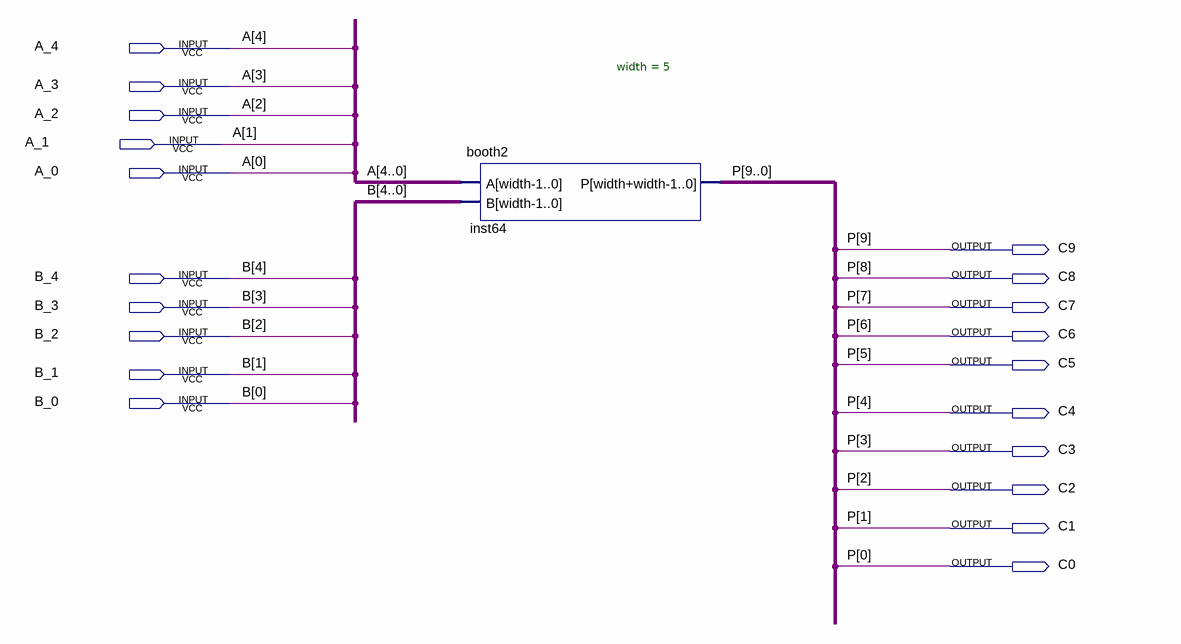
[diagram p0: schematic sheet]
// Quartus schematic Block1.bdf as structural Verilog: 1 symbols, 20 pins
module Block1 (
  input  A_4,
  input  A_3,
  input  A_2,
  input  A_1,
  input  A_0,
  input  B_4,
  input  B_3,
  input  B_2,
  input  B_1,
  input  B_0,
  output C9,
  output C8,
  output C7,
  output C6,
  output C5,
  output C4,
  output C3,
  output C2,
  output C1,
  output C0
);

  booth2 #(.width(5)) inst64 (
    .A({A_4, A_3, A_2, A_1, A_0}), .B({B_4, B_3, B_2, B_1, B_0}), .P({C9, C8, C7, C6, C5, C4, C3, C2, C1, C0}));

  // Other names for the same wires on the sheet: A[4:0] = {A_4, A_3, A_2, A_1, A_0};
  //   B[4:0] = {B_4, B_3, B_2, B_1, B_0}; P[9:0] = {C9, C8, C7, C6, C5, C4, C3, C2, C1, C0}
endmodule
